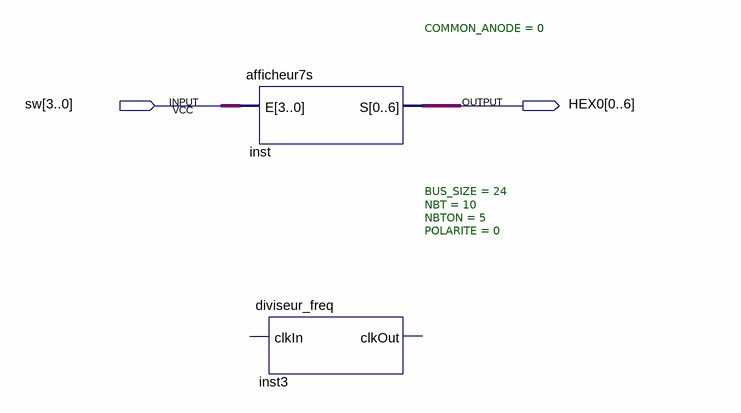
[diagram p0: schematic sheet]
// Quartus schematic AP1_EX3_afficheur7s.bdf as structural Verilog: 2 symbols, 2 pins
module AP1_EX3_afficheur7s (
  input  [3:0] sw,
  output [0:6] HEX0
);

  afficheur7s #(.COMMON_ANODE(0)) inst (.E(sw), .S(HEX0));
  diviseur_freq #(.BUS_SIZE(24), .NBT(10), .NBTON(5), .POLARITE(0)) inst3 ();  // open: clkIn, clkOut
endmodule
